# Altium schematic sheet Sheet1.SchDoc
size 762 x 508 mm; SheetNumber: 1; SheetTotal: 1
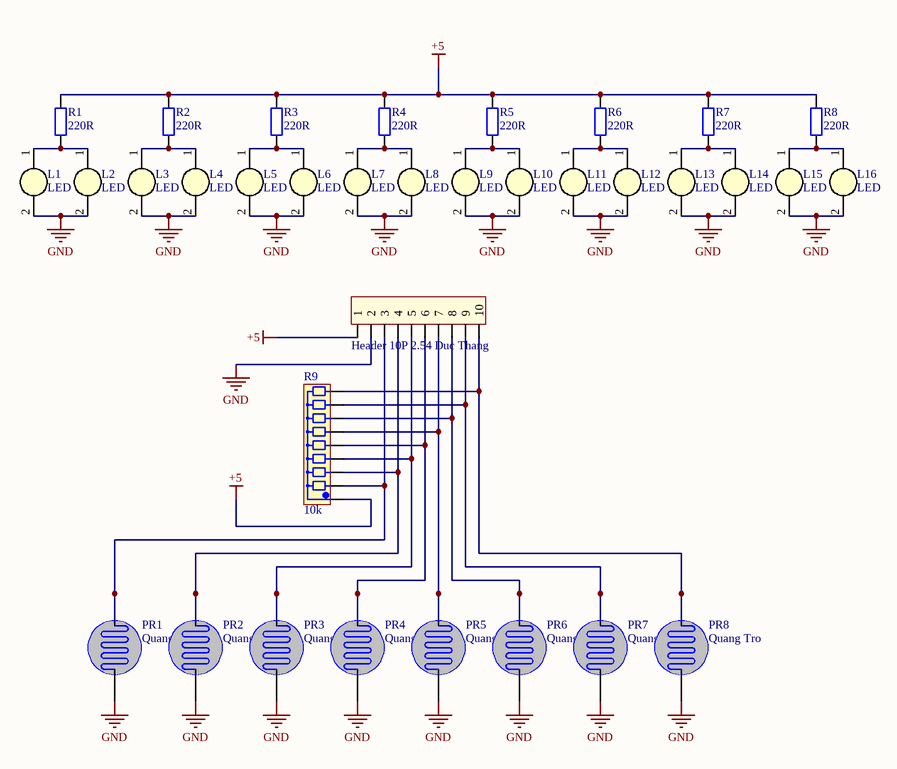
[diagram p0: Sheet1.SchDoc]

## Parts
H1  Header 10P 2.54 Duc Thang  [XH2.54M-10]
L1  LED  [LED-5MM-WHITE]
L2  LED  [LED-5MM-WHITE]
L3  LED  [LED-5MM-WHITE]
L4  LED  [LED-5MM-WHITE]
L5  LED  [LED-5MM-WHITE]
L6  LED  [LED-5MM-WHITE]
L7  LED  [LED-5MM-WHITE]
L8  LED  [LED-5MM-WHITE]
L9  LED  [LED-5MM-WHITE]
L10  LED  [LED-5MM-WHITE]
L11  LED  [LED-5MM-WHITE]
L12  LED  [LED-5MM-WHITE]
L13  LED  [LED-5MM-WHITE]
L14  LED  [LED-5MM-WHITE]
L15  LED  [LED-5MM-WHITE]
L16  LED  [LED-5MM-WHITE]
PR1  Quang Tro  [Quang Tro]
PR2  Quang Tro  [Quang Tro]
PR3  Quang Tro  [Quang Tro]
PR4  Quang Tro  [Quang Tro]
PR5  Quang Tro  [Quang Tro]
PR6  Quang Tro  [Quang Tro]
PR7  Quang Tro  [Quang Tro]
PR8  Quang Tro  [Quang Tro]
R1  220R  [tro vach 1/4w]
R2  220R  [tro vach 1/4w]
R3  220R  [tro vach 1/4w]
R4  220R  [tro vach 1/4w]
R5  220R  [tro vach 1/4w]
R6  220R  [tro vach 1/4w]
R7  220R  [tro vach 1/4w]
R8  220R  [tro vach 1/4w]
R9  10k  [tro bang a9]

## Nets
+5: H1.1 R1.2 R2.2 R3.2 R4.2 R5.2 R6.2 R7.2 R8.2 R9.1
GND: H1.2 L1.2(K) L2.2(K) L3.2(K) L4.2(K) L5.2(K) L6.2(K) L7.2(K) L8.2(K) L9.2(K) L10.2(K) L11.2(K) L12.2(K) L13.2(K) L14.2(K) L15.2(K) L16.2(K) PR1.1 PR2.1 PR3.1 PR4.1 PR5.1 PR6.1 PR7.1 PR8.1
NetH1_3: H1.3 PR1.2 R9.2
NetH1_4: H1.4 PR2.2 R9.3
NetH1_5: H1.5 PR3.2 R9.4
NetH1_6: H1.6 PR4.2 R9.5
NetH1_7: H1.7 PR5.2 R9.6
NetH1_8: H1.8 PR6.2 R9.7
NetH1_9: H1.9 PR7.2 R9.8
NetH1_10: H1.10 PR8.2 R9.9
NetL1_1: L1.1(A) L2.1(A) R1.1
NetL3_1: L3.1(A) L4.1(A) R2.1
NetL5_1: L5.1(A) L6.1(A) R3.1
NetL7_1: L7.1(A) L8.1(A) R4.1
NetL9_1: L9.1(A) L10.1(A) R5.1
NetL11_1: L11.1(A) L12.1(A) R6.1
NetL13_1: L13.1(A) L14.1(A) R7.1
NetL15_1: L15.1(A) L16.1(A) R8.1

## Library data of the parts
H1 = Header 10P 2.54 Duc Thang: Cắm; Ten_Linh_Kien: Header 10P XH2.54-10P Đực Thẳng; Don_Vi: Con; Ma_Hang: MH001286; Chung_Loai: Cắm
L1-L16 = LED 5mm Trang: Cắm; Don_Vi: Con; Ma_Hang: MH008983; Ten_Linh_Kien: Led 5MM Trắng Đục (1000c); Ghi_Chu: *; Kieu_Chan: *; Chung_Loai: Cắm
PR1-PR8 = Quang Tro: Photoresistor; Creator: Bien Nguyen
R1-R8 = Tro Vach 1/4W 5% 220R: Cắm; Don_Vi: Con; So_Chan: 2; Ten_Linh_Kien: Trở Vạch 1/4w 5% 220R; Ma_Hang: MH007300; Chung_Loai: Cắm; Kieu_Chan: *
R9 = Tro Bang A9 100k: Cắm; Don_Vi: Con; So_Chan: 9; Ten_Linh_Kien: Trở Băng A09-104 100k 1/8w 5%; Ma_Hang: MH001443; Chung_Loai: Cắm; Kieu_Chan: *